# EAGLE design Lagopus_B_2 (EAGLE 9.5.2)
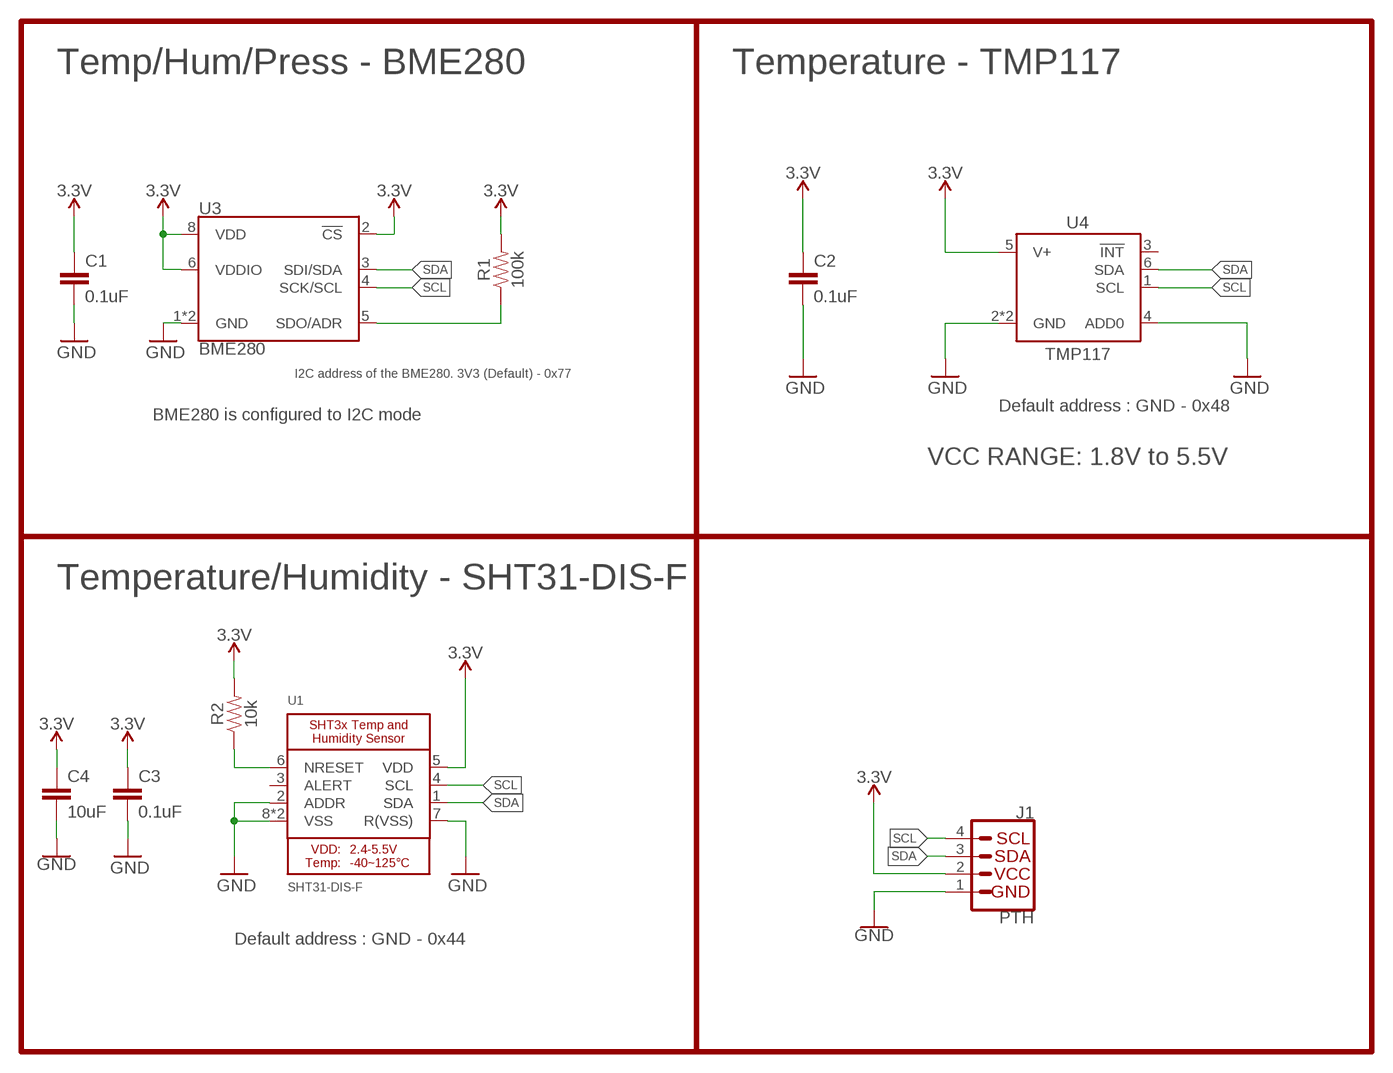
[diagram p0: schematic, sheet 1]

## Parts
C1  0.1uF  0.1UF-0603-25V-(+80/-20%)  [0603]
C2  0.1uF  0.1UF-0603-25V-(+80/-20%)  [0603]
C3  0.1uF  0.1UF-0603-25V-(+80/-20%)  [0603]
C4  10uF  10UF-0603-6.3V-20%  [0603]
J1  PTH  I2C_STANDARD_NO_SILK  [1X04_NO_SILK]
R1  100k  100KOHM-0603-1/10W-1%  [0603]
R2  10k  10KOHM-0603-1/10W-1%  [0603]
U1  SHT31-DIS-F  SHT3X  [SHT3X]
U3  BME280  [LGA-8-2.5X2.5]
U4  TMP117  [TMP117]

## Nets
3.3V: C1.1 C2.1 C3.1 C4.1 J1.2(VCC) R1.2 R2.2 U1.5(VDD) U3.2(!CS) U3.6(VDDIO) U3.8(VDD) U4.5(V+)
GND: C1.2 C2.2 C3.2 C4.2 J1.1(GND) U1.2(ADDR) U1.7(R(VSS)) U1.8(VSS) U1.THERMAL(VSS) U3.1(GND) U3.7(GND) U4.2(GND) U4.4(ADD0) U4.THERMAL(GND)
N$1: R2.1 U1.6(NRESET)
SCL: J1.4(SCL) U1.4(SCL) U3.4(SCK/SCL) U4.1(SCL)
SDA: J1.3(SDA) U1.1(SDA) U3.3(SDI/SDA) U4.6(SDA)
SDO/ADR: R1.1 U3.5(SDO/ADR)
Unconnected: U1.3(ALERT) U4.3(!INT)

## Notes on the sheet
- Temp/Hum/Press - BME280 | Temperature - TMP117
- I2C address of the BME280. 3V3 (Default) - 0x77
- BME280 is configured to I2C mode | Default address : GND - 0x48
- VCC RANGE: 1.8V to 5.5V
- Temperature/Humidity - SHT31-DIS-F
- Default address : GND - 0x44

## Library data of the parts
C1-C3 = SparkFun-Capacitors:0.1UF: 0.1µF ceramic capacitors A capacitor is a passive two-terminal electrical component used to store electrical energy temporarily in an electric field.; PROD_ID: CAP-00810
C4 = SparkFun-Capacitors:10UF: 10.0µF ceramic capacitors A capacitor is a passive two-terminal electrical component used to store electrical energy temporarily in an electric field.; PROD_ID: CAP-11015
J1 = SparkX:I2C_STANDARD: SparkFun I2C Standard Pinout Header SparkFun has standardized on a pinout for all I2C based sensor breakouts. This pinout allows I2C boards to be plugged directly into the headers on Arduino Uno compatible boards, and to be daisy chained easily. Example SparkFun Products: SparkFun Atmospheric Sensor Breakout - BME280 <https://www.sparkfun.com/products/13676> SparkFun Altitude/Pressure Sensor Breakout - MPL3115A2 <https://www.sparkfun.com/products/11084> SparkFun TOF Range Finder Sensor - VL6180 <https://www.sparkfun.com/products/12785>
R1 = SparkFun-Resistors:100KOHM: 100kΩ resistor A resistor is a passive two-terminal electrical component that implements electrical resistance as a circuit element. Resistors act to reduce current flow, and, at the same time, act to lower voltage levels within circuits. - Wikipedia; PROD_ID: RES-07828
R2 = SparkFun-Resistors:10KOHM: 10kΩ resistor A resistor is a passive two-terminal electrical component that implements electrical resistance as a circuit element. Resistors act to reduce current flow, and, at the same time, act to lower voltage levels within circuits. - Wikipedia; PROD_ID: RES-00824
U1 = Lagopus_B_2:SHT3X: SHT3x - Digital Temperature and Humidity Sensor Supply Voltage: 2.4-5.5V Humidity Accuracy: SHT30 = +/-3%RH, SHT31 = +/-2%RH Temperature Sensor: -40~125°C (+/-0.3°C from 10-55C)
U3 = SparkFun-Sensors:BME280: Bosch BME280 – Combined Humidity and Pressure Sensor The BME280 is as combined digital humidity, pressure and temperature sensor based on proven sensing principles. The sensor module is housed in an extremely compact metal-lid LGA package with a footprint of only 2.5×2.5mm² with a height of 0.93mm. Its small dimensions and its low power consumption allow the implementation in battery driven devices such as handsets, GPS modules or watches. Datasheet <https://cdn.sparkfun.com/assets/learn_tutorials/4/1/9/BST-BME280_DS001-10.pdf> SparkFun Products SparkFun Atmospheric Sensor Breakout - BME280 <https://www.sparkfun.com/products/13676> (SEN-13676); PROD_ID: IC-13090
U4 = Lagopus_B_2:TMP117: Temperature Sensor TMP117x High-Accuracy, Low-Power, Digital Temperature Sensor With SMBus™- and I2C-Compatible Interface; PROD_ID: IC-14700

## Board
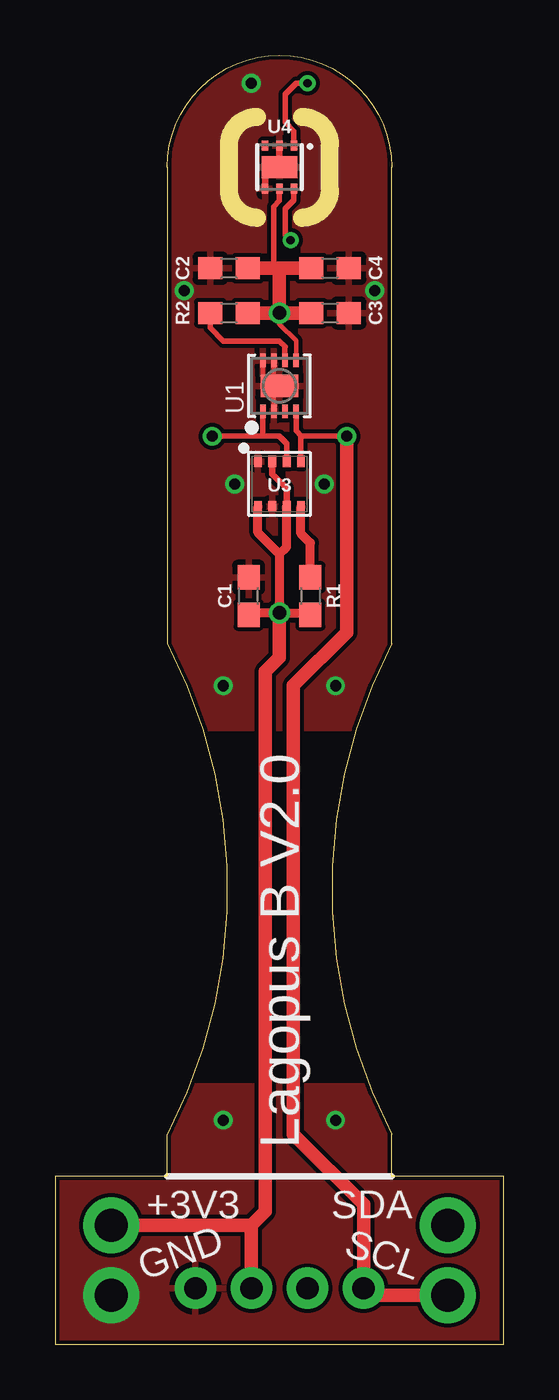
[diagram p1: board, top side]
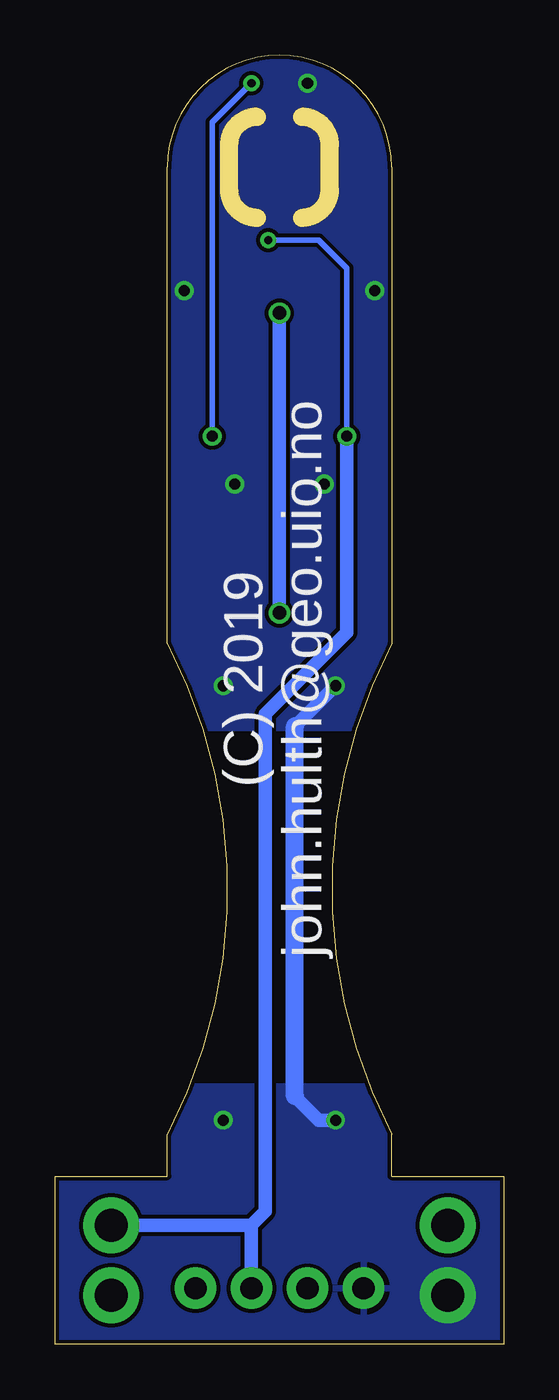
[diagram p2: board, bottom side, seen from below]

Size 20.32 x 58.42 mm. Coordinates in mm from the lower left corner, seen from the top.
Outline: 0,0 20.32,0 20.32,7.62 15.24,7.62 15.24,9.53 arc-55 15.24,31.75 15.24,53.34 arc180 5.08,53.34 5.08,31.75 arc-55 5.08,9.53 5.08,7.62 0,7.62 0,0
Copper layers (1*16): Top 0.035mm / dielectric 1.5mm / Bottom 0.035mm
Design rules "SparkFun-2-layer-TIGHT": minimum track width 7mil, minimum drill 15mil, track to track 7mil, track to pad 7mil, pad to pad 7mil, via to via 7mil, smd to smd 7mil, copper to edge 7mil, drill to drill 7mil, minimum pad ring 7mil, minimum via ring 7mil, stop-mask expansion 4mil, vias tented up to drill 25mil, thermal gap 10mil
Milling: 6 lines

### Footprints (pad centres in the part's own frame; a part is rotated, then mirrored left to right if it is on the bottom)
0603 = smd 1.1 x 1: 1 -0.85,0; 2 0.85,0
1X04_NO_SILK = drill 1.016 pad 1.88: 1 0,0; 2 2.54,0; 3 5.08,0; 4 7.62,0
SHT3X = smd 0.6 x 0.25: 1 -1.15,0.75; 2 -1.15,0.25; 3 -1.15,-0.25; 4 -1.15,-0.75; 5 1.15,-0.75; 6 1.15,-0.25; 7 1.15,0.25; 8 1.15,0.75 | smd 1 x 1.7: THERMAL 0,0
LGA-8-2.5X2.5 = smd 0.35 x 0.5: 1 -0.975,1.025; 2 -0.325,1.025; 3 0.325,1.025; 4 0.975,1.025; 5 0.975,-1.025; 6 0.325,-1.025; 7 -0.325,-1.025; 8 -0.975,-1.025
TMP117 = smd 0.45 x 0.3: 1 -0.975,0.65; 2 -0.975,0; 3 -0.975,-0.65; 4 0.975,-0.65; 5 0.975,0; 6 0.975,0.65 | smd 1 x 1.6: THERMAL 0,0

### Placement (x,y rotation side)
C1  8.76,33.91 90 top
C2  7.87,48.77 180 top
C3  12.45,46.74 0 top
C4  12.45,48.77 0 top
J1  6.35,2.54 0 top
R1  11.56,33.91 270 top
R2  7.87,46.74 0 top
U1  10.16,43.43 90 top
U3  10.16,38.99 0 top
U4  10.16,53.34 270 top

### Tracks (layer width: path | path; a pad name or v marks a point on that pad's centre or on a via)
3.3V  (via drill 0.6, 1.5 pad 2.54)
  Top 0.203: U1.5 10.91,45.48 10.16,46.23 v10.16,46.74
  Top 0.254: 10.16,48.77 9.91,49.02 9.91,51.56 10.16,51.82 U4.5
  Top 0.305: U3.6 10.48,38.79 9.84,39.44 U3.2
  Top 0.406: 10.16,35.81 v10.16,33.15 | U3.6 10.48,36.14 10.16,35.81 | U3.8 9.19,36.79 10.16,35.81 | v10.16,33.15 11.47,33.15 R1.2 | v10.16,33.15 8.85,33.15 C1.1
  Top 0.61: v2.54,5.4 8.89,5.4 | 8.89,5.4 J1.2 | 8.89,5.4 9.53,6.03 9.53,30.48 10.16,31.12 v10.16,33.15 | v10.16,46.74 R2.2 | C2.1 10.16,48.77 | 10.16,48.77 C4.1 | v10.16,46.74 C3.1 | v10.16,46.74 10.16,48.77
  Bottom 0.61: v10.16,33.15 v10.16,46.74
GND  (via drill 0.5, 1.5 pad 2.54)
  Top 0.203: U1.2 9.91,43.18 10.03,43.31 | 10.03,43.31 U1.THERMAL 9.91,43.68 U1.7 | U1.8 9.41,43.93 10.03,43.31
  Top 0.305: U4.2 U4.THERMAL 9.91,53.34 9.51,52.94 U4.4
  Bottom 0.61: 9.46,11.24 8.38,10.16 v7.62,10.16 | 9.46,28 v7.62,29.85
  Bottom 0.813: 9.46,11.24 9.46,28
  other vias: 8.13,38.99 12.19,38.99 2.54,2.22 12.7,10.16 12.7,29.85 8.89,57.15 5.84,47.75 14.48,47.75
  pour Bottom: -1.52,60.77 -1.52,27.94 22.1,27.94 22.1,60.77
  pour Top: -0.51,61.59 21.59,61.59 21.59,27.94 -0.51,27.94
  pour Top: 0,11.68 20.32,11.68 20.32,0 0,0
  pour Bottom: 0,11.68 0,0 20.32,0 20.32,11.68
N$1
  Top 0.254: U1.6 10.41,45.21 10.16,45.47 7.62,45.47 7.02,46.06 R2.1
SCL  (via drill 0.38, 0.5, 1.5 pad 2.54)
  Top 0.254: U1.4 10.91,41.41 11.13,41.19 11.13,41.15 | U3.4 11.13,41.15 | v13.21,41.15 11.13,41.15 | v11.43,57.15 10.92,57.15 10.41,56.64 10.41,55.37 10.81,54.98 U4.1
  Top 0.61: v13.21,41.15 13.21,32.26 10.79,29.85 10.79,9.53 13.97,6.35 J1.4 14.29,2.22 v17.78,2.22
  Bottom 0.254: v13.21,41.15 13.21,55.37 v11.43,57.15
SDA  (via drill 0.38, 0.5, 1.5 pad 2.54)
  Top 0.254: U1.1 9.41,41.15 | v7.11,41.15 9.41,41.15 | 9.41,41.15 10.16,41.15 10.48,40.82 U3.3 | U4.6 10.81,51.85 10.41,51.46 10.41,50.29 v10.67,50.04
  Bottom 0.254: v10.67,50.04 8.38,50.04 7.11,48.77 v7.11,41.15
  Bottom 0.61: 11.43,5.4 10.79,6.03 10.79,28.57 7.11,32.26 v7.11,41.15 | 11.43,5.4 v17.78,5.4 | J1.3 11.43,5.4
SDO/ADR
  Top 0.406: R1.1 11.56,36.32 11.13,36.74 U3.5

### Text on the board
tNames: Lagopus B V2.0 | +3V3 | SDA | GND | SCL
bNames: (C) 2019 / john.hulth@geo.uio.no